# EAGLE schematic Reflow Control Board Rev 2 (EAGLE 6.5.0)
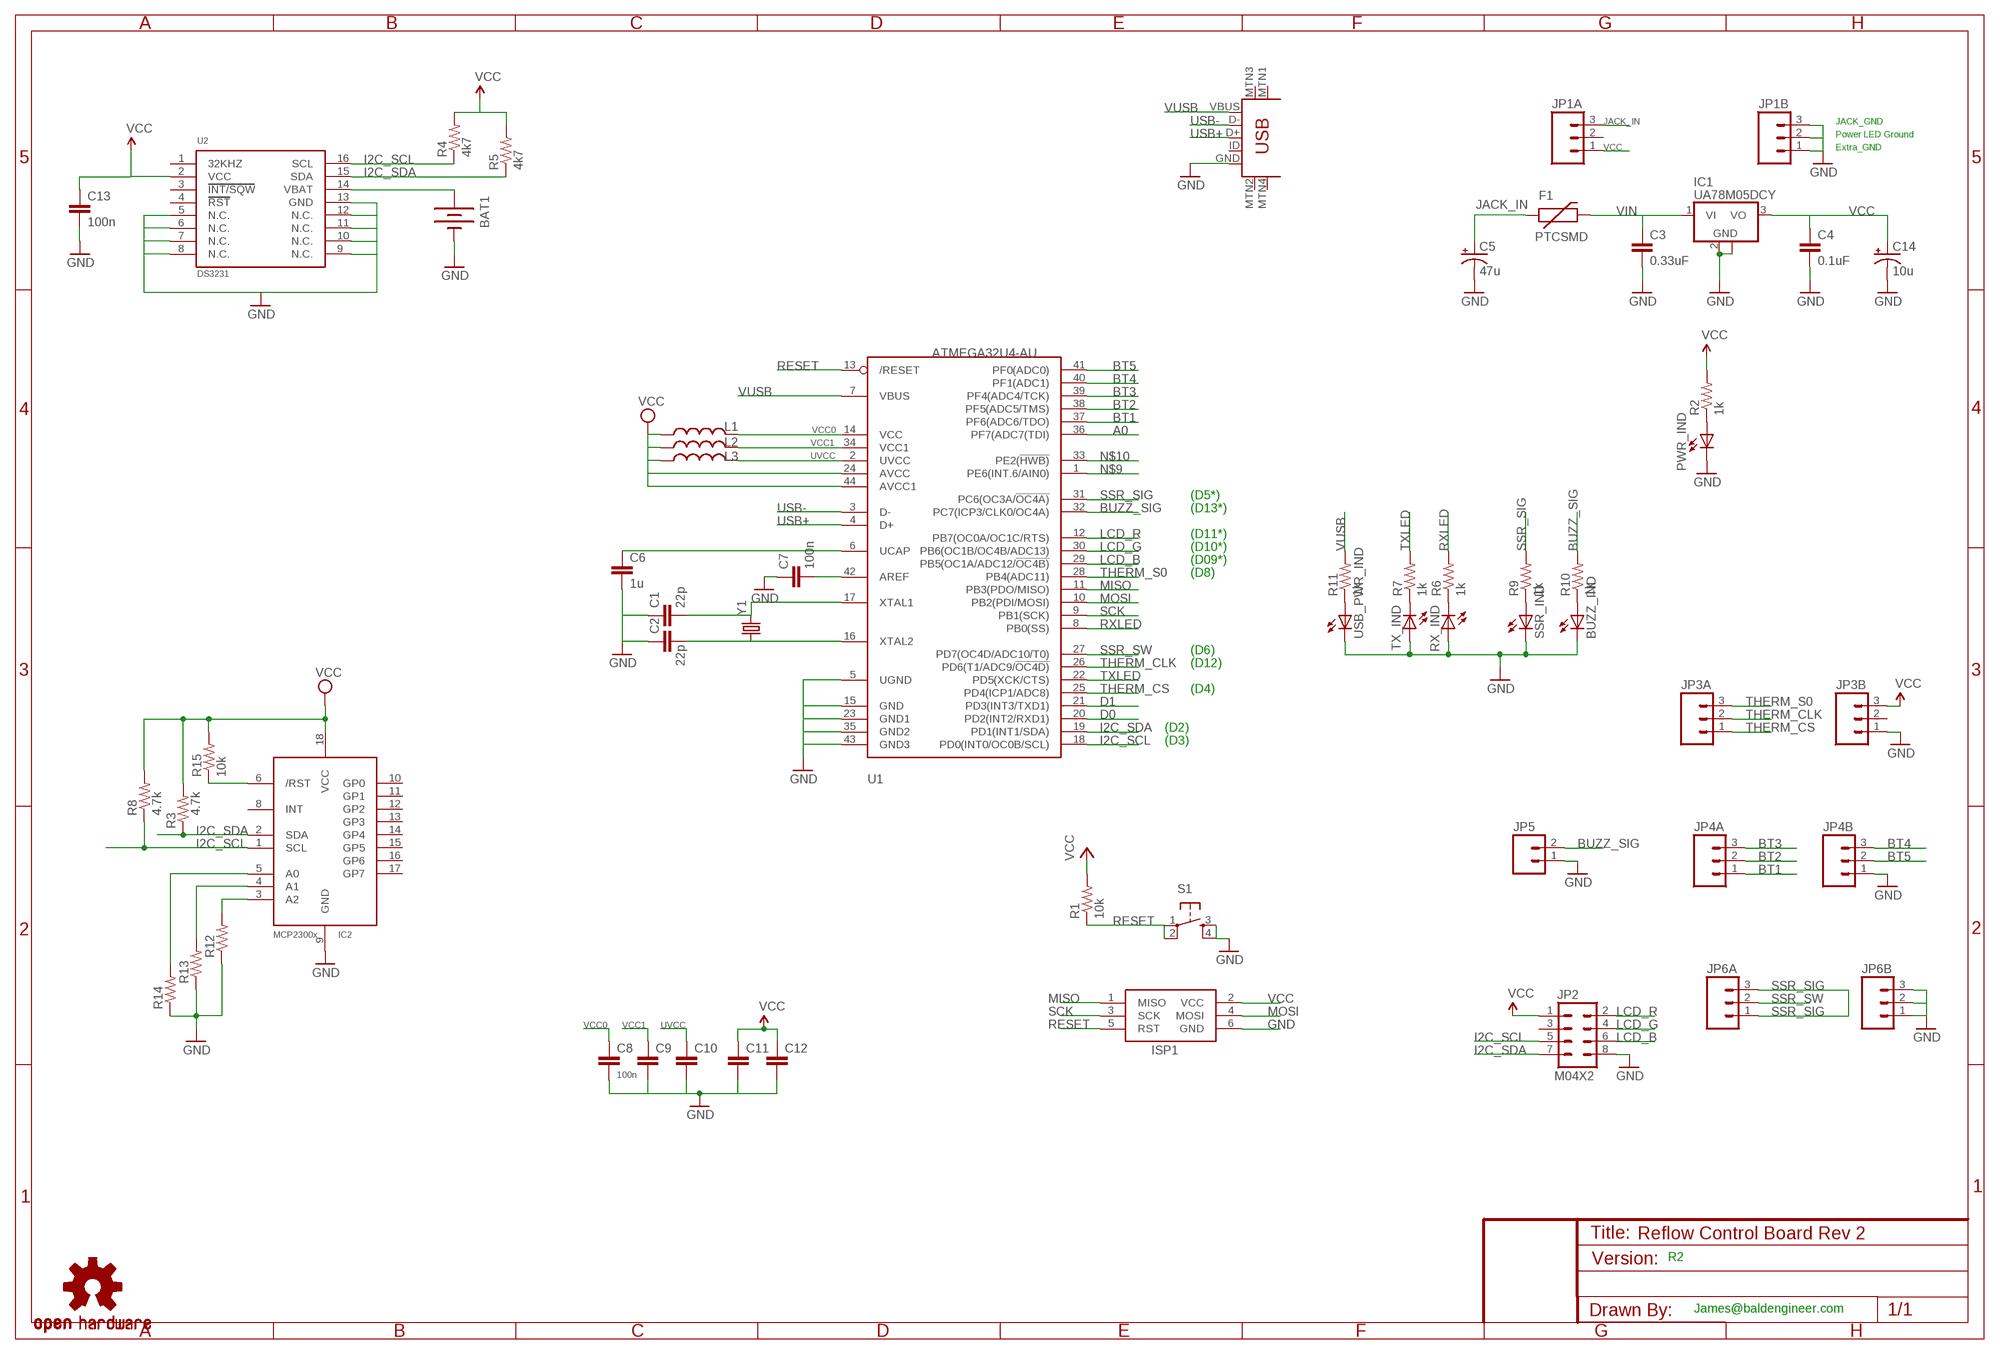
[diagram p0: schematic, sheet 1]

## Parts
BAT1  BATTERY12MM  [BATTCON_12MM]
BUZZ_IND  LED1206  [LED-1206]
C1  22p  CAP1206  [1206]
C2  22p  CAP1206  [1206]
C3  0.33uF  CAP1206  [1206]
C4  0.1uF  CAP1206  [1206]
C5  47u  CPOL-USD/7343-31R  [D/7343-31R]
C6  1u  CAP1206  [1206]
C7  100n  CAP1206  [1206]
C8  100n  CAP1206  [1206]
C9  100n  CAP1206  [1206]
C10  100n  CAP1206  [1206]
C11  100n  CAP1206  [1206]
C12  100n  CAP1206  [1206]
C13  100n  CAP1206  [1206]
C14  10u  CPOL-USD/7343-31R  [D/7343-31R]
F1  PTCSMD  [PTC-1206]
IC1  UA78M05DCY  [SOT223]
IC2  MCP2300X/SO  [SO18W]
ISP1  AVRISP-6  [AVRISP]
JP1A  M03LOCK  [1X03_LOCK]
JP1B  M03LOCK  [1X03_LOCK]
JP2  M04X2  [2X4]
JP3A  M03LOCK  [1X03_LOCK]
JP3B  M03LOCK  [1X03_LOCK]
JP4A  M03LOCK  [1X03_LOCK]
JP4B  M03LOCK  [1X03_LOCK]
JP5  M02LOCK  [1X02_LOCK]
JP6A  M03LOCK  [1X03_LOCK]
JP6B  M03LOCK  [1X03_LOCK]
L1  INDUCTOR0805  [0805]
L2  INDUCTOR0805  [0805]
L3  INDUCTOR0805  [0805]
PWR_IND  LED1206  [LED-1206]
R1  10k  RESISTOR1206  [1206]
R2  1k  RESISTOR1206  [1206]
R3  4.7k  RESISTOR1206  [1206]
R4  4k7  RESISTOR1206  [1206]
R5  4k7  RESISTOR1206  [1206]
R6  1k  RESISTOR1206  [1206]
R7  1k  RESISTOR1206  [1206]
R8  4.7k  RESISTOR1206  [1206]
R9  1k  RESISTOR1206  [1206]
R10  1k  RESISTOR1206  [1206]
R11  1k  RESISTOR1206  [1206]
R12  RESISTOR1206  [1206]
R13  RESISTOR1206  [1206]
R14  RESISTOR1206  [1206]
R15  10k  RESISTOR1206  [1206]
RX_IND  LED1206  [LED-1206]
S1  TAC_SWITCHSMD  [TACTILE_SWITCH_SMD]
SSR_IND  LED1206  [LED-1206]
TX_IND  LED1206  [LED-1206]
U1  ATMEGA32U4-AU  [TQFP44]
U2  DS3231  [SO16L]
U$3  USB-MINIB-5PIN  [USB-MINIB]
U$4  OSHW-LOGOS  [OSHW-LOGO-S]
USB_PWR_IND  LED1206  [LED-1206]
Y1  CRYSTALHC49US  [HC49US]

## Nets
A0: U1.36(PF7(ADC7(TDI))
BT1: JP4A.1 U1.37(PF6(ADC6/TDO))
BT2: JP4A.2 U1.38(PF5(ADC5/TMS))
BT3: JP4A.3 U1.39(PF4(ADC4/TCK))
BT4: JP4B.3 U1.40(PF1(ADC1))
BT5: JP4B.2 U1.41(PF0(ADC0))
BUZZ_SIG: JP5.2 R10.2 U1.32(PC7(ICP3/CLK0/OC4A))
D0: U1.20(PD2(INT2/RXD1))
D1: U1.21(PD3(INT3/TXD1))
GND: BAT1.GND(-) BUZZ_IND.C C1.1 C2.1 C3.2 C4.2 C5.- C6.2 C7.1 C8.2 C9.2 C10.2 C11.2 C12.2 C13.2 C14.- IC1.2(GND) IC1.4(GND) IC2.9(GND) ISP1.6(GND) JP1B.1 JP1B.2 JP1B.3 JP2.8 JP3B.1 JP4B.1 JP5.1 JP6B.1 JP6B.2 JP6B.3 PWR_IND.C R12.1 R13.1 R14.1 RX_IND.A S1.3 S1.4 SSR_IND.C TX_IND.A U1.5(UGND) U1.15(GND) U1.23(GND1) U1.35(GND2) U1.43(GND3) U2.5(N.C.) U2.6(N.C.) U2.7(N.C.) U2.8(N.C.) U2.9(N.C.) U2.10(N.C.) U2.11(N.C.) U2.12(N.C.) U2.13(GND) U$3.GND USB_PWR_IND.C
I2C_SCL: IC2.1(SCL) JP2.5 R4.1 R8.1 U1.18(PD0(INT0/OC0B/SCL)) U2.16(SCL)
I2C_SDA: IC2.2(SDA) JP2.7 R3.1 R5.1 U1.19(PD1(INT1/SDA)) U2.15(SDA)
JACK_IN: C5.+ F1.1 JP1A.3
LCD_B: JP2.6 U1.29(PB5(OC1A/ADC12/!OC4B))
LCD_G: JP2.4 U1.30(PB6(OC1B/OC4B/ADC13))
LCD_R: JP2.2 U1.12(PB7(OC0A/OC1C/RTS))
MISO: ISP1.1(MISO) U1.11(PB3(PDO/MISO))
MOSI: ISP1.4(MOSI) U1.10(PB2(PDI/MOSI))
N$1: C1.2 U1.17(XTAL1) Y1.2
N$2: C2.2 U1.16(XTAL2) Y1.1
N$3: R7.1 TX_IND.C
N$4: C6.1 U1.6(UCAP)
N$5: C7.2 U1.42(AREF)
N$6: PWR_IND.A R2.1
N$7: R6.1 RX_IND.C
N$8: R9.1 SSR_IND.A
N$9: U1.1(PE6(INT.6/AIN0))
N$10: U1.33(PE2(!HWB))
N$12: BAT1.PWR@2(+) U2.14(VBAT)
N$13: IC2.3(A2) R12.2
N$14: BUZZ_IND.A R10.1
N$15: R11.1 USB_PWR_IND.A
N$17: IC2.4(A1) R13.2
N$18: IC2.5(A0) R14.2
N$20: IC2.6(/RST) R15.1
RESET: ISP1.5(RST) R1.1 S1.1 S1.2 U1.13(/RESET)
RXLED: R6.2 U1.8(PB0(SS))
SCK: ISP1.3(SCK) U1.9(PB1(SCK))
SSR_SIG: JP6A.1 JP6A.3 R9.2 U1.31(PC6(OC3A/!OC4A))
SSR_SW: JP6A.2 U1.27(PD7(OC4D/ADC10/T0))
THERM_CLK: JP3A.2 U1.26(PD6(T1/ADC9/!OC4D))
THERM_CS: JP3A.1 U1.25(PD4(ICP1/ADC8))
THERM_S0: JP3A.3 U1.28(PB4(ADC11))
TXLED: R7.2 U1.22(PD5(XCK/CTS))
USB+: U1.4(D+) U$3.D+
USB-: U1.3(D-) U$3.D-
UVCC: C10.1 L3.2 U1.2(UVCC)
VCC: C4.1 C11.1 C12.1 C13.1 C14.+ IC1.3(VO) IC2.18(VCC) ISP1.2(VCC) JP1A.1 JP2.1 JP3B.3 L1.1 L2.1 L3.1 R1.2 R2.2 R3.2 R4.2 R5.2 R8.2 R15.2 U1.24(AVCC) U1.44(AVCC1) U2.2(VCC)
VCC0: C8.1 L1.2 U1.14(VCC)
VCC1: C9.1 L2.2 U1.34(VCC1)
VIN: C3.1 F1.2 IC1.1(VI)
VUSB: R11.2 U1.7(VBUS) U$3.VBUS
Unconnected: IC2.8(INT) IC2.10(GP0) IC2.11(GP1) IC2.12(GP2) IC2.13(GP3) IC2.14(GP4) IC2.15(GP5) IC2.16(GP6) IC2.17(GP7) JP1A.2 JP2.3 JP3B.2 U2.1(32KHZ) U2.3(INT/SQW) U2.4(RST) U$3.ID U$3.MTN1(MTN2) U$3.MTN2(MTN3) U$3.MTN3(MTN1) U$3.MTN4

## Notes on the sheet
- JACK_GND
- Power LED Ground
- Extra_GND
- (D5*)
- (D13*)
- (D11*)
- (D10*)
- (D09*)
- (D8)
- (D6)
- (D12)
- (D4)
- (D2)
- (D3)
- R2
- James@baldengineer.com

## Library data of the parts
BAT1 = Add-Ohms:BATTERY: Battery Holders Various common sizes : AA, AAA, 20mm coin cell and 12mm coin cell.
BUZZ_IND PWR_IND RX_IND SSR_IND TX_IND USB_PWR_IND = Add-Ohms:LED: LEDs Standard schematic elements and footprints for 5mm, 3mm, 1206, and 0603 sized LEDs. 5mm - Spark Fun Electronics SKU : COM-00529 (and others)
C1-C4 C6-C13 = Add-Ohms:CAP: Capacitor Standard 0603 ceramic capacitor, and 0.1" leaded capacitor.
C5 C14 = rcl:CPOL-US: POLARIZED CAPACITOR, American symbol
F1 = SparkFun:PTC: Resettable Fuse PTC Resettable Fuse. Spark Fun Electronics SKU : COM-08357
IC1 = linear:UA78M*: POSITIVE-VOLTAGE REGULATORS Source: http://focus.ti.com/lit/ds/symlink/ua78m33.pdf
IC2 = adafruit:MCP2300X: MCP23008 Inexpensive i2c i/o expander - 8 general purpose i/o pins with optional pullups
ISP1 = adafruit:AVRISP: AVR ISP HEADER Standard 6 pin header for AVR programming
JP1A JP1B JP3A JP3B JP4A JP4B JP6A JP6B = SparkFun:M03: Header 3 Standard 3-pin 0.1" header. Use with straight break away headers (SKU : PRT-00116), right angle break away headers (PRT-00553), swiss pins (PRT-00743), machine pins (PRT-00117), and female headers (PRT-00115). Molex polarized connector foot print use with SKU : PRT-08232 with associated crimp pins and housings.
JP2 = SparkFun:M04X2
JP5 = SparkFun:M02: Header 2 Standard 2-pin 0.1" header. Use with straight break away headers (SKU : PRT-00116), right angle break away headers (PRT-00553), swiss pins (PRT-00743), machine pins (PRT-00117), and female headers (PRT-00115). Molex polarized connector foot print use with SKU : PRT-08233 with associated crimp pins and housings.
L1-L3 = Add-Ohms:INDUCTOR: Inductors Basic Inductor/Choke - 0603 and 1206. Footprints are not proven and vary greatly between part numbers.
R1-R15 = Add-Ohms:RESISTOR: Resistor Basic schematic elements and footprints for 0603, 1206, and PTH resistors.
S1 = Add-Ohms:TAC_SWITCH: Momentary Switch Button commonly used for reset or general input. Spark Fun Electronics SKU : COM-00097
U1 = adafruit:ATMEGA32U4: http://www.ladyada.net/library/eagle
U2 = Add-Ohms:DS3231: The DS3231 is a low-cost, extremely accurate I2C real- time clock (RTC) with an integrated temperature- compensated crystal oscillator (TCXO) and crystal. Link to maxim-ic.com: http://www.maxim-ic.com/datasheet/index.mvp/id/4627 The package style is the SOIC-16. This Part was created by James Lewis (james@cmiyc.com). The SMD/PCB footprint was obtained from the Sparkfun Eagle Library. This part (as an indepedant library) can be downloaded from cmiyc.com: <insert link>. Last Update: May 28, 2012.
U$3 = SparkFun:USB-MINIB: Mini-USB "B" connector with 5th pin broken out. Created new symbol breaking out 5th "ID" pin in mini/micro USB connector spec. See: http://en.wikipedia.org/wiki/Mini_usb#Cables. Uses same footprint as 4-pin symbol. Also added pins to connect to mounting / shield pads if required (probably not generally needed as signals aren't shielded once they leave the connector).
U$4 = Add-Ohms:OSHW-LOGO: Open Source Hardware Logo This logo indicates the piece of hardware it is found on incorporates a OSHW license and/or adheres to the definition of open source hardware found here: http://freedomdefined.org/OSHW
Y1 = SparkFun:CRYSTAL: Crystals Various standard crystals. Proven footprints. Spark Fun Electronics SKU : COM-00534